# EasyEDA Pro project Source_r00fu_Synth .epro, board PCB1_1
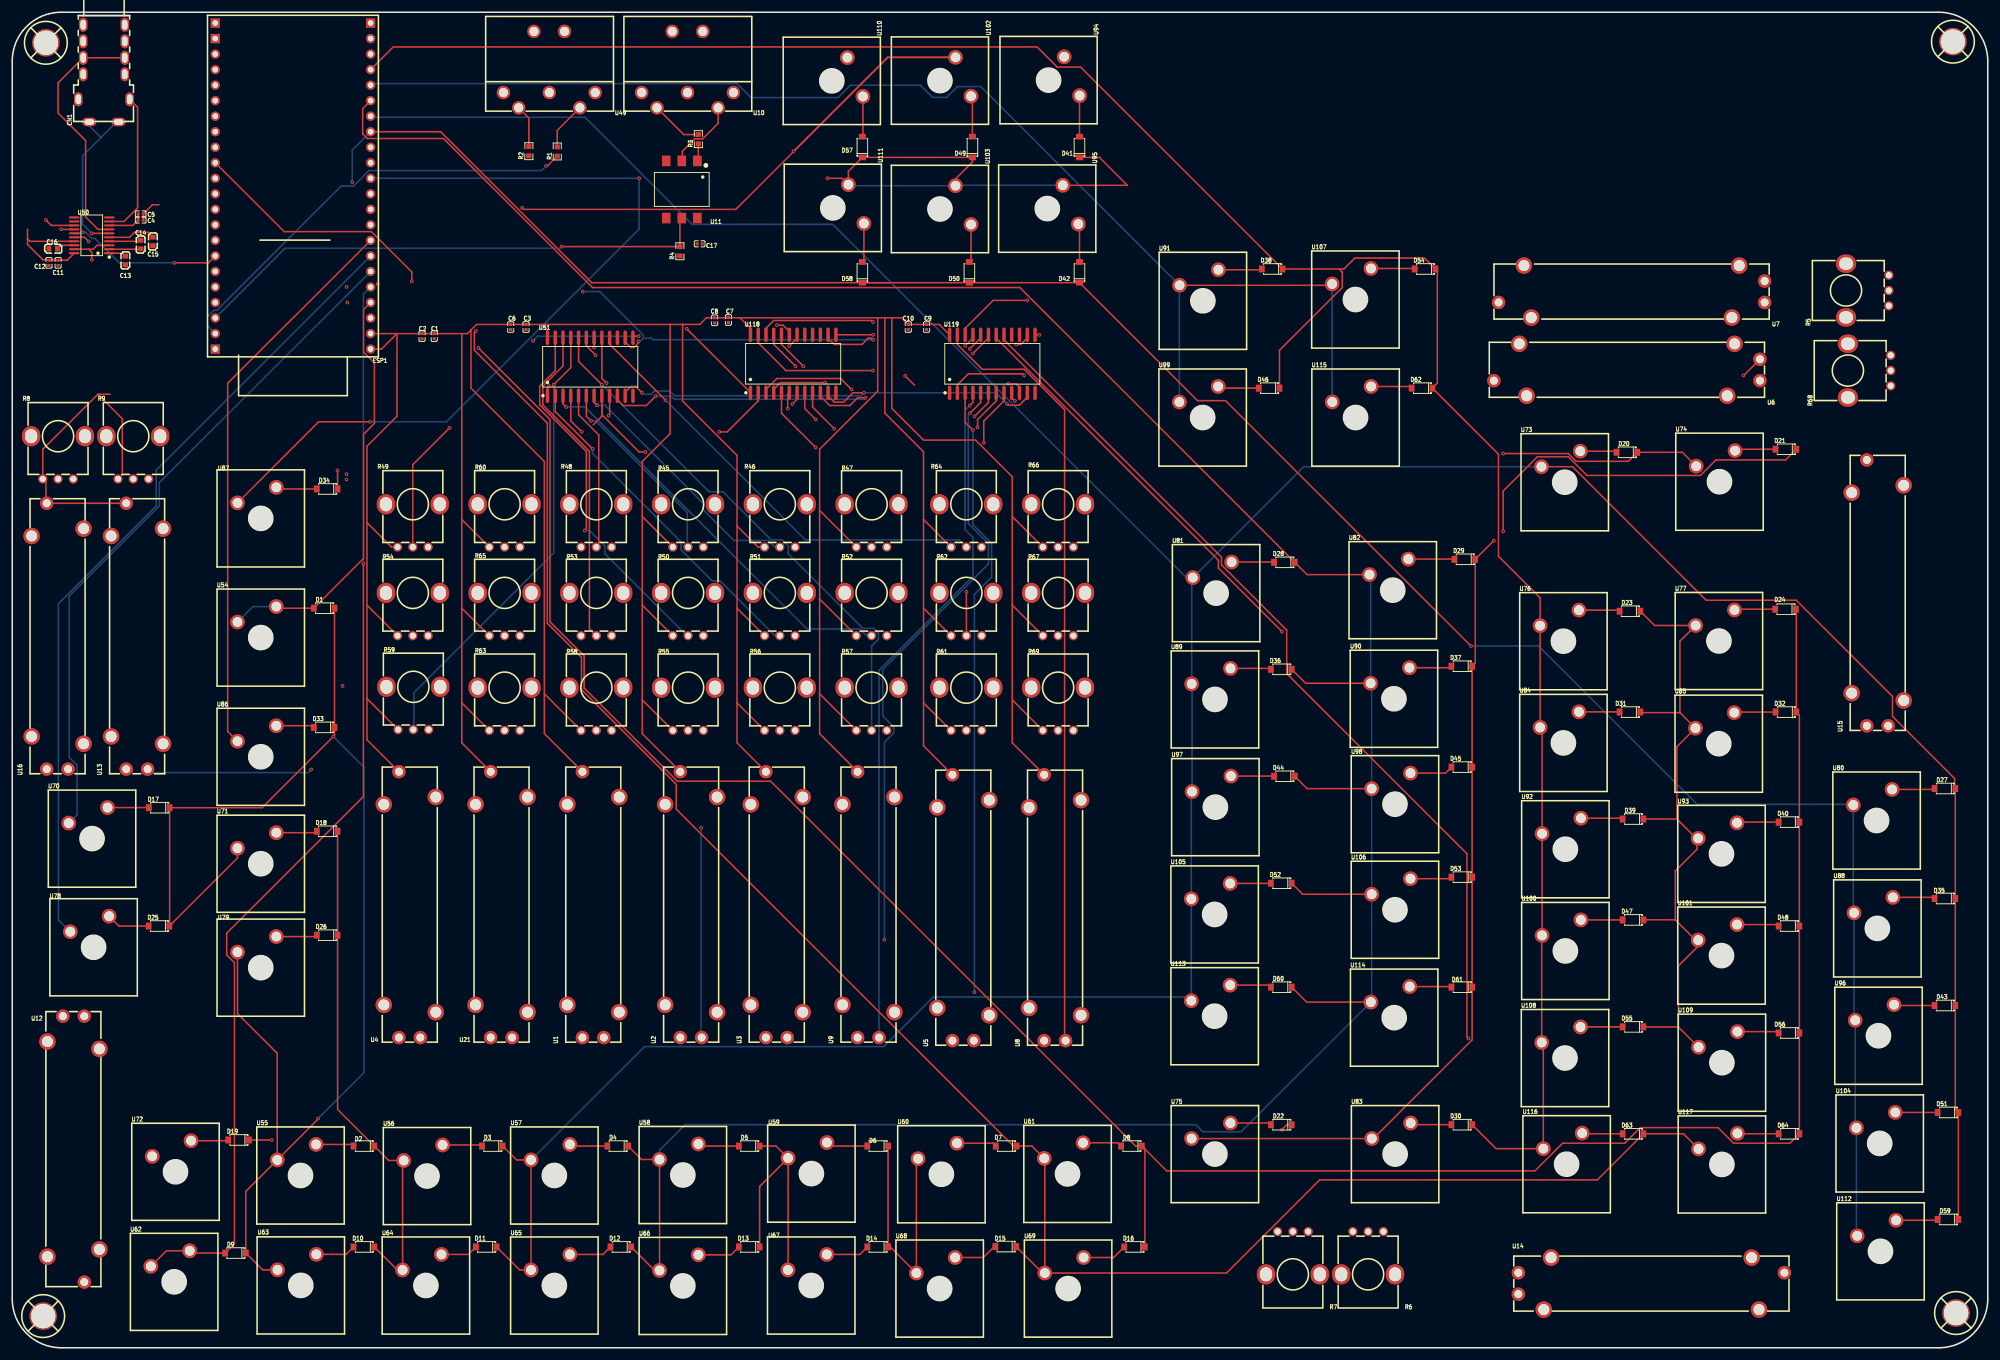
[diagram p3: board, top side]
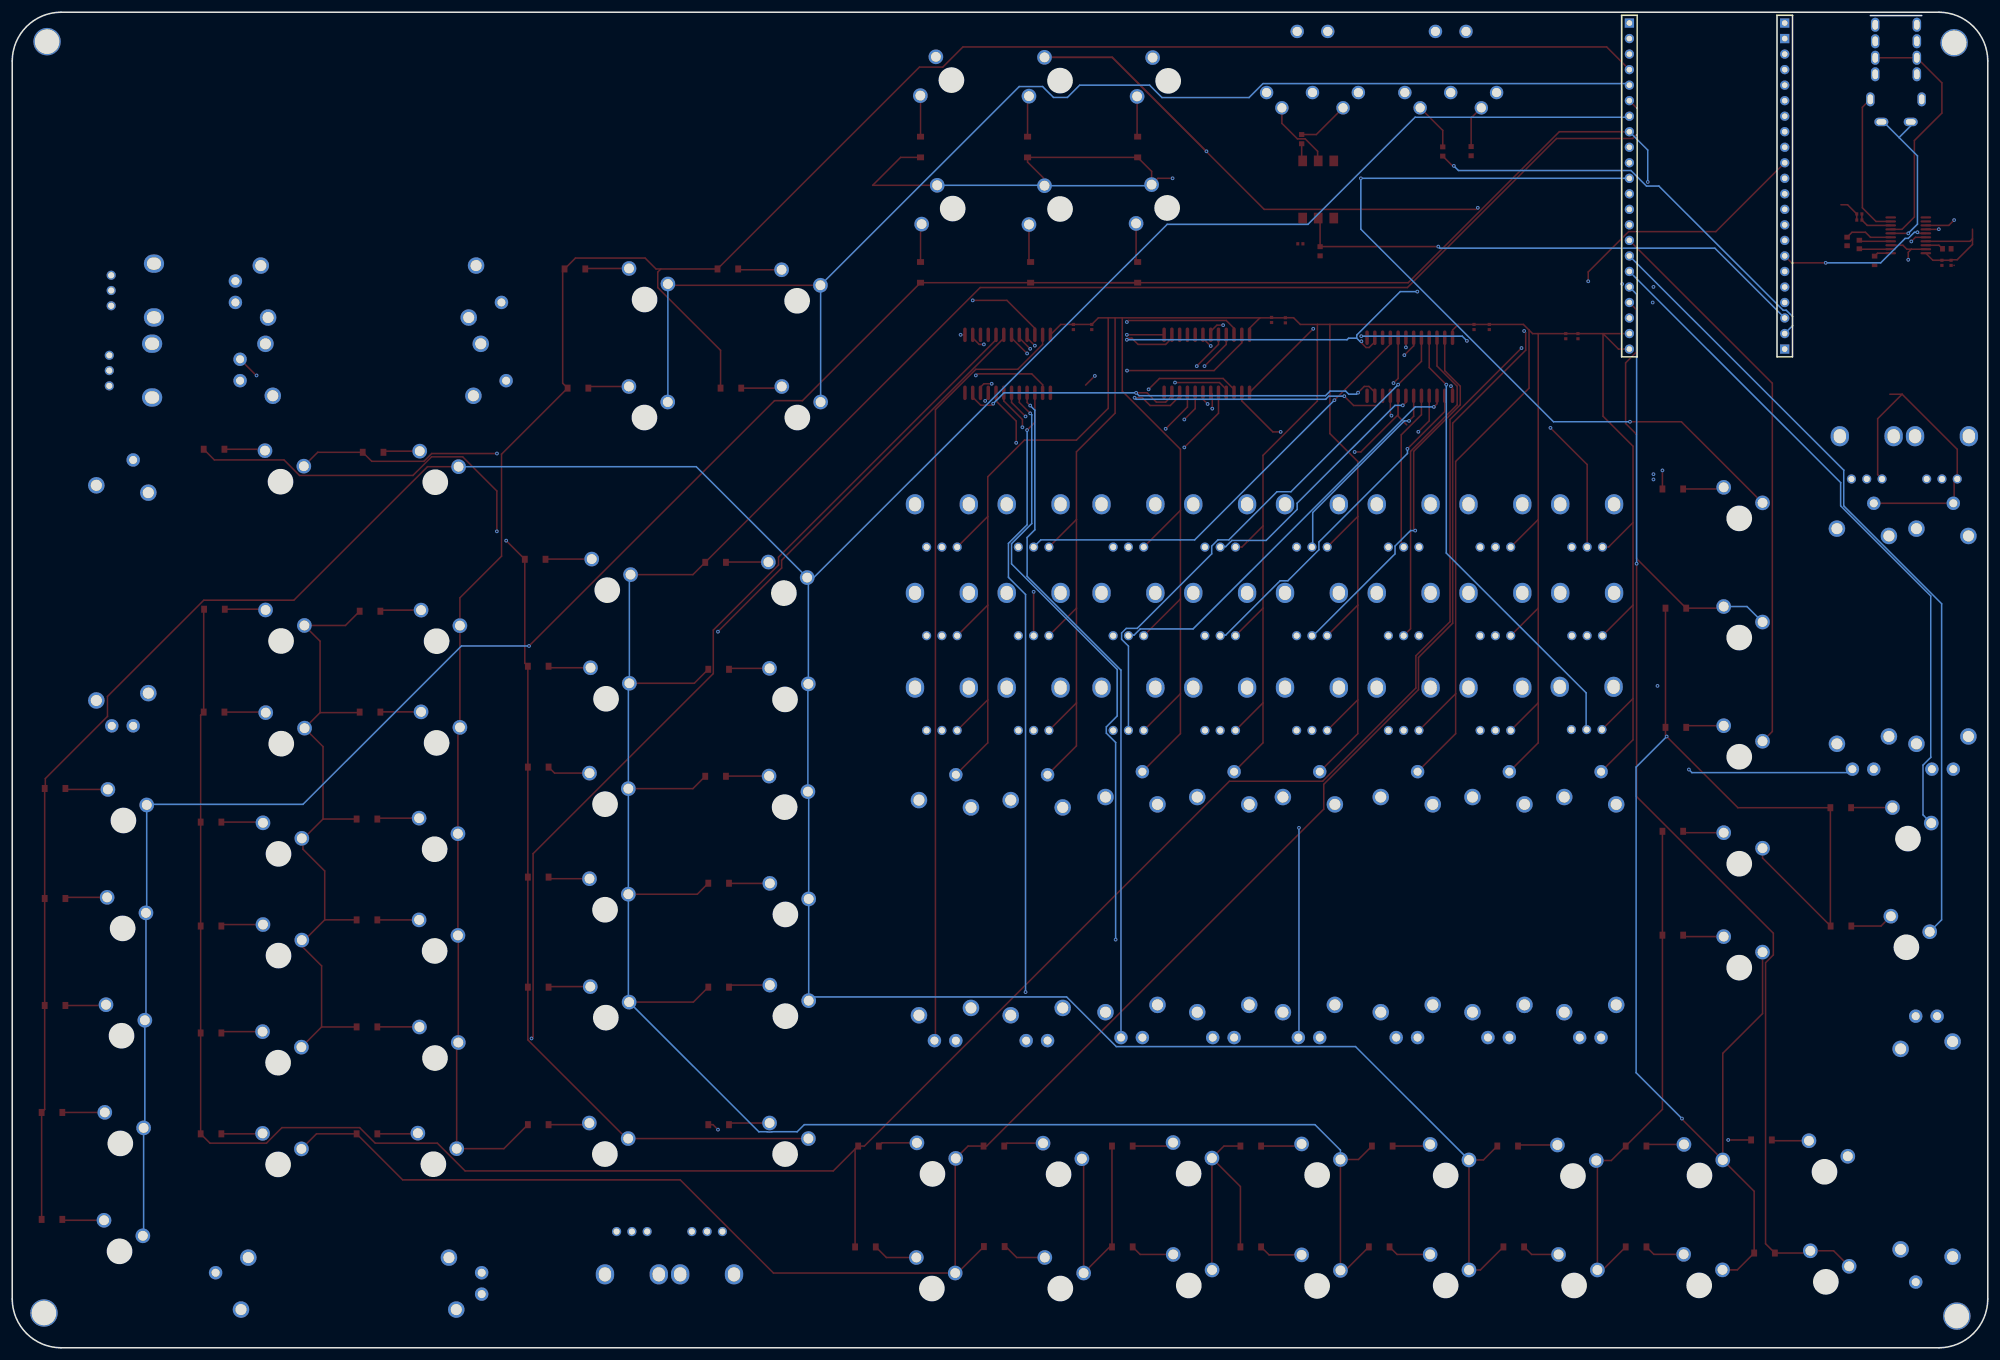
[diagram p4: board, bottom side, seen from below]

Outline 323 x 218.5 mm; copper layers: Top Layer, Inner1, Inner2, Bottom Layer. Coordinates in mm from the lower left corner of the outline.
Outline path: 0,210.5 0,8 arc(2.34,2.34) 8,0 315,0 arc(320.66,2.34) 323,8 323,210.5 arc(320.66,216.16) 315,218.5 8,218.5 arc(2.34,216.16) 0,210.5
Stack: Top Layer 0.035mm Outer layer thickness 1oz / Dielectric1 0.2104mm 7628 RC49% 8.6mil / Inner1 0.0152mm Inner layer thickness / Dielectric2 1.065mm 1.1mm H/HOZ Copper / Inner2 0.0152mm Inner layer thickness / Dielectric3 0.2104mm 7628 RC49% 8.6mil / Bottom Layer 0.035mm Outer layer thickness 1oz

## Design rules (mm)
spacing copperThickness1oz (default): track to track 0.102, other pairs 0.152 to 0.3
spacing copperThickness2oz: track to track 0.203, other pairs 0.152 to 0.3
track width copperThickness1oz (default): min 0.127, default 0.254, max 2.54
track width copperThickness2oz: min 0.203, default 0.254, max 2.54
differential pair differentialPair (default): width min 0.127, default 0.254, max 2.54; gap min 0.152, default 0.152

## Placement (name value [footprint] x y rotation side)
C1  100nF  [C0402]  69 165.5 90 top
C2  10uF  [C0402]  67 165.5 90 top
C3  100nF  [C0402]  84 167 90 top
C4  100nF  [C0402]  21 184.5 180 top
C5  10uF  [C0402]  21 185.5 180 top
C6  10uF  [C0402]  81.5 167 90 top
C7  100nF  [C0402]  117.1 168.16 90 top
C8  10uF  [C0402]  114.84 168.1 90 top
C9  100nF  [C0402]  149.5 167 90 top
C10  10uF  [C0402]  146.5 167 90 top
C11  100nF  [C0402]  7.5 177.5 90 top
C12  10uF  [C0402]  6 177.5 90 top
C13  1uF  [C0603]  18.5 177.9 270 top
C14  1uF  [C0603]  21 180.5 90 top
C15  1uF  [C0603]  23 181 270 top
C16  1uF  [C0603]  6.7 179.8 0 top
C17  100nF  [C0402]  112.39 180.61 180 top
CN1  PJ-4506B-01-Z  [AUDIO-TH_PJ-4506B-01-Z]  15 208.5 90 top
D1  1N4148W  [SOD-123_L2.8-W1.8-LS3.7-RD-1]  51 121 180 top
D2  1N4148W  [SOD-123_L2.8-W1.8-LS3.7-RD-1]  57.5 33 180 top
D3  1N4148W  [SOD-123_L2.8-W1.8-LS3.7-RD-1]  78.5 33 180 top
D4  1N4148W  [SOD-123_L2.8-W1.8-LS3.7-RD-1]  99 33 180 top
D5  1N4148W  [SOD-123_L2.8-W1.8-LS3.7-RD-1]  120.5 33 180 top
D6  1N4148W  [SOD-123_L2.8-W1.8-LS3.7-RD-1]  141.5 33 180 top
D7  1N4148W  [SOD-123_L2.8-W1.8-LS3.7-RD-1]  162.5 33 180 top
D8  1N4148W  [SOD-123_L2.8-W1.8-LS3.7-RD-1]  183 33 180 top
D9  1N4148W  [SOD-123_L2.8-W1.8-LS3.7-RD-1]  36.5 15.5 180 top
D10  1N4148W  [SOD-123_L2.8-W1.8-LS3.7-RD-1]  57.5 16.5 180 top
D11  1N4148W  [SOD-123_L2.8-W1.8-LS3.7-RD-1]  77.5 16.5 180 top
D12  1N4148W  [SOD-123_L2.8-W1.8-LS3.7-RD-1]  99.5 16.5 180 top
D13  1N4148W  [SOD-123_L2.8-W1.8-LS3.7-RD-1]  120.5 16.5 180 top
D14  1N4148W  [SOD-123_L2.8-W1.8-LS3.7-RD-1]  141.5 16.5 180 top
D15  1N4148W  [SOD-123_L2.8-W1.8-LS3.7-RD-1]  162.44 16.55 180 top
D16  1N4148W  [SOD-123_L2.8-W1.8-LS3.7-RD-1]  183.5 16.5 180 top
D17  1N4148W  [SOD-123_L2.8-W1.8-LS3.7-RD-1]  24.04 88.35 180 top
D18  1N4148W  [SOD-123_L2.8-W1.8-LS3.7-RD-1]  51.5 84.5 180 top
D19  1N4148W  [SOD-123_L2.8-W1.8-LS3.7-RD-1]  37 34 180 top
D20  1N4148W  [SOD-123_L2.8-W1.8-LS3.7-RD-1]  264 146.5 180 top
D21  1N4148W  [SOD-123_L2.8-W1.8-LS3.7-RD-1]  290 147 180 top
D22  1N4148W  [SOD-123_L2.8-W1.8-LS3.7-RD-1]  207.5 36.5 180 top
D23  1N4148W  [SOD-123_L2.8-W1.8-LS3.7-RD-1]  264.5 120.5 180 top
D24  1N4148W  [SOD-123_L2.8-W1.8-LS3.7-RD-1]  289.94 120.83 180 top
D25  1N4148W  [SOD-123_L2.8-W1.8-LS3.7-RD-1]  24 69 180 top
D26  1N4148W  [SOD-123_L2.8-W1.8-LS3.7-RD-1]  51.5 67.5 180 top
D27  1N4148W  [SOD-123_L2.8-W1.8-LS3.7-RD-1]  316 91.5 180 top
D28  1N4148W  [SOD-123_L2.8-W1.8-LS3.7-RD-1]  208 128.5 180 top
D29  1N4148W  [SOD-123_L2.8-W1.8-LS3.7-RD-1]  237.5 129 180 top
D30  1N4148W  [SOD-123_L2.8-W1.8-LS3.7-RD-1]  237 36.5 180 top
D31  1N4148W  [SOD-123_L2.8-W1.8-LS3.7-RD-1]  264.5 104 180 top
D32  1N4148W  [SOD-123_L2.8-W1.8-LS3.7-RD-1]  290 104 180 top
D33  1N4148W  [SOD-123_L2.8-W1.8-LS3.7-RD-1]  51 101.5 180 top
D34  1N4148W  [SOD-123_L2.8-W1.8-LS3.7-RD-1]  51.5 140.5 180 top
D35  1N4148W  [SOD-123_L2.8-W1.8-LS3.7-RD-1]  316 73.5 180 top
D36  1N4148W  [SOD-123_L2.8-W1.8-LS3.7-RD-1]  207.5 111 180 top
D37  1N4148W  [SOD-123_L2.8-W1.8-LS3.7-RD-1]  237 111.5 180 top
D38  1N4148W  [SOD-123_L2.8-W1.8-LS3.7-RD-1]  206 176.5 180 top
D39  1N4148W  [SOD-123_L2.8-W1.8-LS3.7-RD-1]  265 86.5 180 top
D40  1N4148W  [SOD-123_L2.8-W1.8-LS3.7-RD-1]  290.5 86 180 top
D41  1N4148W  [SOD-123_L2.8-W1.8-LS3.7-RD-1]  174.49 196.44 90 top
D42  1N4148W  [SOD-123_L2.8-W1.8-LS3.7-RD-1]  174.49 175.94 90 top
D43  1N4148W  [SOD-123_L2.8-W1.8-LS3.7-RD-1]  316 56 180 top
D44  1N4148W  [SOD-123_L2.8-W1.8-LS3.7-RD-1]  208 93.5 180 top
D45  1N4148W  [SOD-123_L2.8-W1.8-LS3.7-RD-1]  237 95 180 top
D46  1N4148W  [SOD-123_L2.8-W1.8-LS3.7-RD-1]  205.5 157 180 top
D47  1N4148W  [SOD-123_L2.8-W1.8-LS3.7-RD-1]  265 70 180 top
D48  1N4148W  [SOD-123_L2.8-W1.8-LS3.7-RD-1]  290.5 69 180 top
D49  1N4148W  [SOD-123_L2.8-W1.8-LS3.7-RD-1]  156.99 196.44 90 top
D50  1N4148W  [SOD-123_L2.8-W1.8-LS3.7-RD-1]  156.49 175.94 90 top
D51  1N4148W  [SOD-123_L2.8-W1.8-LS3.7-RD-1]  316.5 38.5 180 top
D52  1N4148W  [SOD-123_L2.8-W1.8-LS3.7-RD-1]  207.5 76 180 top
D53  1N4148W  [SOD-123_L2.8-W1.8-LS3.7-RD-1]  237 77 180 top
D54  1N4148W  [SOD-123_L2.8-W1.8-LS3.7-RD-1]  231 176.5 180 top
D55  1N4148W  [SOD-123_L2.8-W1.8-LS3.7-RD-1]  265 52.5 180 top
D56  1N4148W  [SOD-123_L2.8-W1.8-LS3.7-RD-1]  290.5 51.5 180 top
D57  1N4148W  [SOD-123_L2.8-W1.8-LS3.7-RD-1]  138.99 196.44 90 top
D58  1N4148W  [SOD-123_L2.8-W1.8-LS3.7-RD-1]  138.99 175.94 90 top
D59  1N4148W  [SOD-123_L2.8-W1.8-LS3.7-RD-1]  316.5 21 180 top
D60  1N4148W  [SOD-123_L2.8-W1.8-LS3.7-RD-1]  207.5 59 180 top
D61  1N4148W  [SOD-123_L2.8-W1.8-LS3.7-RD-1]  237 59 180 top
D62  1N4148W  [SOD-123_L2.8-W1.8-LS3.7-RD-1]  230.5 157 180 top
D63  1N4148W  [SOD-123_L2.8-W1.8-LS3.7-RD-1]  265 35 180 top
D64  1N4148W  [SOD-123_L2.8-W1.8-LS3.7-RD-1]  290.5 35 180 top
ESP1  ESP32-S3-DEVKITC-MINI  [ESP32S3-DEVKIT-C1-V10]  58.6 163.39 180 top
R1  220Ω  [R0603]  89.11 195.72 90 top
R2  220Ω  [R0603]  84.47 195.77 90 top
R3  220Ω  [R0603]  112.18 197.74 90 top
R4  10kΩ  [R0603]  109.16 179.39 90 top
R5  10kΩ  [RES-ADJ-TH_RK09K1130A5R]  303.32 172.97 90 top
R6  10kΩ  [RES-ADJ-TH_RK09K1130A5R]  221.69 15.51 180 top
R7  10kΩ  [RES-ADJ-TH_RK09K1130A5R]  209.39 15.51 180 top
R8  10kΩ  [RES-ADJ-TH_RK09K1130A5R]  7.49 145.64 0 top
R9  10kΩ  [RES-ADJ-TH_RK09K1130A5R]  19.79 145.64 0 top
R45  10kΩ  [RES-ADJ-TH_RK09K1130A5R]  110.5 134.5 0 top
R46  10kΩ  [RES-ADJ-TH_RK09K1130A5R]  125.5 134.5 0 top
R47  10kΩ  [RES-ADJ-TH_RK09K1130A5R]  140.5 134.5 0 top
R48  10kΩ  [RES-ADJ-TH_RK09K1130A5R]  95.5 134.5 0 top
R49  10kΩ  [RES-ADJ-TH_RK09K1130A5R]  65.5 134.5 0 top
R50  10kΩ  [RES-ADJ-TH_RK09K1130A5R]  110.5 120 0 top
R51  10kΩ  [RES-ADJ-TH_RK09K1130A5R]  125.5 120 0 top
R52  10kΩ  [RES-ADJ-TH_RK09K1130A5R]  140.5 120 0 top
R53  10kΩ  [RES-ADJ-TH_RK09K1130A5R]  95.5 120 0 top
R54  10kΩ  [RES-ADJ-TH_RK09K1130A5R]  65.5 120 0 top
R55  10kΩ  [RES-ADJ-TH_RK09K1130A5R]  110.5 104.5 0 top
R56  10kΩ  [RES-ADJ-TH_RK09K1130A5R]  125.5 104.5 0 top
R57  10kΩ  [RES-ADJ-TH_RK09K1130A5R]  140.5 104.5 0 top
R58  10kΩ  [RES-ADJ-TH_RK09K1130A5R]  95.5 104.5 0 top
R59  10kΩ  [RES-ADJ-TH_RK09K1130A5R]  65.58 104.63 0 top
R60  10kΩ  [RES-ADJ-TH_RK09K1130A5R]  80.5 134.5 0 top
R61  10kΩ  [RES-ADJ-TH_RK09K1130A5R]  156 104.5 0 top
R62  10kΩ  [RES-ADJ-TH_RK09K1130A5R]  156 120 0 top
R63  10kΩ  [RES-ADJ-TH_RK09K1130A5R]  80.5 104.5 0 top
R64  10kΩ  [RES-ADJ-TH_RK09K1130A5R]  156 134.5 0 top
R65  10kΩ  [RES-ADJ-TH_RK09K1130A5R]  80.5 120 0 top
R66  10kΩ  [RES-ADJ-TH_RK09K1130A5R]  171 134.5 0 top
R67  10kΩ  [RES-ADJ-TH_RK09K1130A5R]  171 120 0 top
R68  10kΩ  [RES-ADJ-TH_RK09K1130A5R]  303.63 159.87 90 top
R69  10kΩ  [RES-ADJ-TH_RK09K1130A5R]  171 104.5 0 top
SCREW1  -  [Screw-Hole-M4]  5.5 213.5 0 top
SCREW2  -  [Screw-Hole-M4]  317.31 213.69 0 top
SCREW3  -  [Screw-Hole-M4]  5.06 5.19 0 top
SCREW4  -  [Screw-Hole-M4]  317.81 5.69 0 top
U1  PTA3043-2010CIB103  [RES-ADJ-TH_PTA3043]  95 72.5 90 top
U2  PTA3043-2010CIB103  [RES-ADJ-TH_PTA3043]  111 72.5 90 top
U3  PTA3043-2010CIB103  [RES-ADJ-TH_PTA3043]  125 72.5 90 top
U4  PTA3043-2010CIB103  [RES-ADJ-TH_PTA3043]  65 72.5 90 top
U5  PTA3043-2010CIB103  [RES-ADJ-TH_PTA3043]  155.5 72 90 top
U6  PTA3043-2010CIB103  [RES-ADJ-TH_PTA3043]  264 160 180 top
U7  PTA3043-2010CIB103  [RES-ADJ-TH_PTA3043]  264.76 172.8 180 top
U8  PTA3043-2010CIB103  [RES-ADJ-TH_PTA3043]  170.5 72 90 top
U9  PTA3043-2010CIB103  [RES-ADJ-TH_PTA3043]  140 72.5 90 top
U10  DIN-504D-M5  [CONN-TH_DIN-504D-M5]  110.41 209.11 180 top
U11  H11L1SR2M  [SMD-6_L8.7-W6.5-P2.54-LS10.6-BL]  109.47 189.5 180 top
U12  PTA3043-2010CIB103  [RES-ADJ-TH_PTA3043]  10 32.5 270 top
U13  PTA3043-2010CIB103  [RES-ADJ-TH_PTA3043]  20.41 116.41 90 top
U14  PTA3043-2010CIB103  [RES-ADJ-TH_PTA3043]  268 10.5 0 top
U15  PTA3043-2010CIB103  [RES-ADJ-TH_PTA3043]  305 123.5 90 top
U16  PTA3043-2010CIB103  [RES-ADJ-TH_PTA3043]  7.41 116.41 90 top
U21  PTA3043-2010CIB103  [RES-ADJ-TH_PTA3043]  80 72.5 90 top
U49  DIN-504D-M5  [CONN-TH_DIN-504D-M5]  87.81 209.11 180 top
U50  PCM5102APW  [TSSOP-20_L6.5-W4.4-P0.65-LS6.4-BL]  13 182 90 top
U51  CD74HC4067M  [SOIC-24_L15.4-W7.5-P1.27-LS10.3-BL]  94.5 160.5 0 top
U54  CPG151101D01  [SW-TH_CPG151101D9X]  40 120 0 top
U55  CPG151101D01  [SW-TH_CPG151101D9X]  46.5 32 0 top
U56  CPG151101D01  [SW-TH_CPG151101D9X]  67.19 31.91 0 top
U57  CPG151101D01  [SW-TH_CPG151101D9X]  88 32 0 top
U58  CPG151101D01  [SW-TH_CPG151101D9X]  109.01 32.07 0 top
U59  CPG151101D01  [SW-TH_CPG151101D9X]  130.03 32.31 0 top
U60  CPG151101D01  [SW-TH_CPG151101D9X]  151.29 32.2 0 top
U61  CPG151101D01  [SW-TH_CPG151101D9X]  171.91 32.26 0 top
U62  CPG151101D01  [SW-TH_CPG151101D9X]  25.84 14.6 0 top
U63  CPG151101D01  [SW-TH_CPG151101D9X]  46.55 14.02 0 top
U64  CPG151101D01  [SW-TH_CPG151101D9X]  67 14 0 top
U65  CPG151101D01  [SW-TH_CPG151101D9X]  88 14 0 top
U66  CPG151101D01  [SW-TH_CPG151101D9X]  109.01 13.93 0 top
U67  CPG151101D01  [SW-TH_CPG151101D9X]  130 14 0 top
U68  CPG151101D01  [SW-TH_CPG151101D9X]  151 13.5 0 top
U69  CPG151101D01  [SW-TH_CPG151101D9X]  172 13.5 0 top
U70  CPG151101D01  [SW-TH_CPG151101D9X]  12.41 87.11 0 top
U71  CPG151101D01  [SW-TH_CPG151101D9X]  40 83 0 top
U72  CPG151101D01  [SW-TH_CPG151101D9X]  26.06 32.6 0 top
U73  CPG151101D01  [SW-TH_CPG151101D9X]  253.2 145.42 0 top
U74  CPG151101D01  [SW-TH_CPG151101D9X]  278.5 145.5 0 top
U75  CPG151101D01  [SW-TH_CPG151101D9X]  196 35.5 0 top
U76  CPG151101D01  [SW-TH_CPG151101D9X]  252.98 119.41 0 top
U77  CPG151101D01  [SW-TH_CPG151101D9X]  278.41 119.44 0 top
U78  CPG151101D01  [SW-TH_CPG151101D9X]  12.67 69.34 0 top
U79  CPG151101D01  [SW-TH_CPG151101D9X]  40 66 0 top
U80  CPG151101D01  [SW-TH_CPG151101D9X]  304.19 90.08 0 top
U81  CPG151101D01  [SW-TH_CPG151101D9X]  196.2 127.28 0 top
U82  CPG151101D01  [SW-TH_CPG151101D9X]  225.08 127.76 0 top
U83  CPG151101D01  [SW-TH_CPG151101D9X]  225.47 35.5 0 top
U84  CPG151101D01  [SW-TH_CPG151101D9X]  252.98 102.77 0 top
U85  CPG151101D01  [SW-TH_CPG151101D9X]  278.38 102.64 0 top
U86  CPG151101D01  [SW-TH_CPG151101D9X]  40 100.5 0 top
U87  CPG151101D01  [SW-TH_CPG151101D9X]  40 139.5 0 top
U88  CPG151101D01  [SW-TH_CPG151101D9X]  304.31 72.42 0 top
U89  CPG151101D01  [SW-TH_CPG151101D9X]  196.01 109.88 0 top
U90  CPG151101D01  [SW-TH_CPG151101D9X]  225.28 109.99 0 top
U91  CPG151101D01  [SW-TH_CPG151101D9X]  194.04 175.1 0 top
U92  CPG151101D01  [SW-TH_CPG151101D9X]  253.3 85.38 0 top
U93  CPG151101D01  [SW-TH_CPG151101D9X]  278.83 84.61 0 top
U94  CPG151101D01  [SW-TH_CPG151101D9X]  173.25 208.03 270 top
U95  CPG151101D01  [SW-TH_CPG151101D9X]  173.04 187.01 270 top
U96  CPG151101D01  [SW-TH_CPG151101D9X]  304.5 54.86 0 top
U97  CPG151101D01  [SW-TH_CPG151101D9X]  196.08 92.26 0 top
U98  CPG151101D01  [SW-TH_CPG151101D9X]  225.44 92.75 0 top
U99  CPG151101D01  [SW-TH_CPG151101D9X]  194 156 0 top
U100  CPG151101D01  [SW-TH_CPG151101D9X]  253.3 68.73 0 top
U101  CPG151101D01  [SW-TH_CPG151101D9X]  278.83 67.97 0 top
U102  CPG151101D01  [SW-TH_CPG151101D9X]  155.49 207.94 270 top
U103  CPG151101D01  [SW-TH_CPG151101D9X]  155.49 186.94 270 top
U104  CPG151101D01  [SW-TH_CPG151101D9X]  304.69 37.24 0 top
U105  CPG151101D01  [SW-TH_CPG151101D9X]  195.95 74.71 0 top
U106  CPG151101D01  [SW-TH_CPG151101D9X]  225.44 75.47 0 top
U107  CPG151101D01  [SW-TH_CPG151101D9X]  218.98 175.31 0 top
U108  CPG151101D01  [SW-TH_CPG151101D9X]  253.24 51.21 0 top
U109  CPG151101D01  [SW-TH_CPG151101D9X]  278.9 50.45 0 top
U110  CPG151101D01  [SW-TH_CPG151101D9X]  137.81 207.9 270 top
U111  CPG151101D01  [SW-TH_CPG151101D9X]  137.98 187.12 270 top
U112  CPG151101D01  [SW-TH_CPG151101D9X]  304.82 19.59 0 top
U113  CPG151101D01  [SW-TH_CPG151101D9X]  195.95 58.06 0 top
U114  CPG151101D01  [SW-TH_CPG151101D9X]  225.31 57.82 0 top
U115  CPG151101D01  [SW-TH_CPG151101D9X]  219 156 0 top
U116  CPG151101D01  [SW-TH_CPG151101D9X]  253.51 33.84 0 top
U117  CPG151101D01  [SW-TH_CPG151101D9X]  278.9 33.81 0 top
U118  CD74HC4067M  [SOIC-24_L15.4-W7.5-P1.27-LS10.3-BL]  127.68 160.99 0 top
U119  CD74HC4067M  [SOIC-24_L15.4-W7.5-P1.27-LS10.3-BL]  160.25 160.98 0 top

## Footprints (pads in the part's own frame, mm; a bottom-side part is the same pattern mirrored in y, then rotated)
AUDIO-TH_PJ-4506B-01-Z
  oval 2.3x1.4 hole 1.6x0.9: A(7.95,-3.4) B(5.25,-3.4) C(2.55,-3.4) D(-0.15,-3.4) E(7.95,3.4) F(5.25,3.4) G(2.55,3.4) H(-0.15,3.4) K(-4.25,-4.2) L(-4.25,4.2)
  oval 1.4x2.3 hole 0.9x1.6: I(-7.95,-2.4) J(-7.95,2.4)
C0402
  rect 0.5x0.54 smd: 1(-0.42,0) 2(0.42,0)
C0603
  rect 0.8x0.9 smd: 1(-0.7,0) 2(0.7,0)
CONN-TH_DIN-504D-M5
  round 2.2 hole 1.5: 1(7.5,3.75) 2(0,3.75) 3(-7.5,3.75) 4(5,6.25) 5(-5,6.25) 6(-2.5,-6.25) 7(2.5,-6.25)
ESP32S3-DEVKIT-C1-V10
  round 1.524 hole 0.914: 0(25.4,-33.02) 1(25.4,-7.62) 2(25.4,-10.16) 3(0,-30.48) 4(0,-7.62) 5(0,-10.16) 5V(0,-50.8) 6(0,-12.7) 7(0,-15.24) 8(0,-27.94) 9(0,-35.56) 10(0,-38.1) 11(0,-40.64) 12(0,-43.18) 13(0,-45.72) 14(0,-48.26) 15(0,-17.78) 16(0,-20.32) 17(0,-22.86) 18(0,-25.4) 19(25.4,-48.26) 20(25.4,-45.72) 21(25.4,-43.18) 35(25.4,-30.48) 36(25.4,-27.94) 37(25.4,-25.4) 38(25.4,-22.86) 39(25.4,-20.32) 40(25.4,-17.78) 41(25.4,-15.24) 42(25.4,-12.7) 45(25.4,-35.56) 46(0,-33.02) 47(25.4,-40.64) 48(25.4,-38.1) RST(0,-5.08) RX(25.4,-5.08) TX(25.4,-2.54) VDD_1(0,0) VDD_2(0,-2.54)
  rect 1.524x1.524 hole 0.914: G1(0,-53.34) G2(25.4,0) G3(25.4,-50.8) G4(25.4,-53.34)
R0603
  rect 0.806x0.864 smd: 1(-0.753,0) 2(0.753,0)
RES-ADJ-TH_PTA3043
  round 2.2 hole 1.3: 1(-21.75,1.778) 2(-21.75,-1.722) 3(21.75,1.778)
  round 2.7 hole 1.8: 4(16.4,4.25) 5(-16.4,4.25) 6(-17.6,-4.25) 7(17.6,-4.25)
RES-ADJ-TH_RK09K1130A5R
  round 1.5 hole 1: 1(-2.5,-3.5) 2(0,-3.5) 3(2.5,-3.5)
  oval 3x3.3 hole 2x2.3: 4(4.4,3.5) 5(-4.4,3.5)
Screw-Hole-M4
  round 4.5 hole 4: 1(0,0)
SMD-6_L8.7-W6.5-P2.54-LS10.6-BL
  rect 1.423x1.75 smd: 1(-2.54,-4.675) 2(0,-4.675) 3(2.54,-4.675) 4(2.54,4.675) 5(0,4.675) 6(-2.54,4.675)
SOD-123_L2.8-W1.8-LS3.7-RD-1
  rect 0.95x1.15 smd: 1(-1.692,0) 2(1.692,0)
SOIC-24_L15.4-W7.5-P1.27-LS10.3-BL
  oval 0.574x2.388 smd: 1(-6.985,-4.744) 2(-5.715,-4.744) 3(-4.445,-4.744) 4(-3.175,-4.744) 5(-1.905,-4.744) 6(-0.635,-4.744) 7(0.635,-4.744) 8(1.905,-4.744) 9(3.175,-4.744) 10(4.445,-4.744) 11(5.715,-4.744) 12(6.985,-4.744) 13(6.985,4.744) 14(5.715,4.744) 15(4.445,4.744) 16(3.175,4.744) 17(1.905,4.744) 18(0.635,4.744) 19(-0.635,4.744) 20(-1.905,4.744) 21(-3.175,4.744) 22(-4.445,4.744) 23(-5.715,4.744) 24(-6.985,4.744)
SW-TH_CPG151101D9X
  round 2.4 hole 1.6: 1(-3.175,-1.27) 2(3.175,1.27)
TSSOP-20_L6.5-W4.4-P0.65-LS6.4-BL
  oval 0.364x1.742 smd: 1(-2.925,-2.871) 2(-2.275,-2.871) 3(-1.625,-2.871) 4(-0.975,-2.871) 5(-0.325,-2.871) 6(0.325,-2.871) 7(0.975,-2.871) 8(1.625,-2.871) 9(2.275,-2.871) 10(2.925,-2.871) 11(2.925,2.871) 12(2.275,2.871) 13(1.625,2.871) 14(0.975,2.871) 15(0.325,2.871) 16(-0.325,2.871) 17(-0.975,2.871) 18(-1.625,2.871) 19(-2.275,2.871) 20(-2.925,2.871)

## Nets
+3.3V: C1.2 C2.2 C3.2 C4.2 C5.2 C6.2 C7.2 C8.2 C9.2 C10.2 C11.2 C12.2 C13.1 C17.2 ESP1.VDD_1 ESP1.VDD_2 R2.1 R4.1 R5.1 R6.1 R7.1 R8.1 R9.1 R45.1 R46.1 R47.1 R48.1 R49.1 R50.1 R51.1 R52.1 R53.1 R54.1 R55.1 R56.1 R57.1 R58.1 R59.1 R60.1 R61.1 R62.1 R63.1 R64.1 R65.1 R66.1 R67.1 R68.1 R69.1 U1.3 U2.3 U3.3 U4.3 U5.3 U6.3 U7.3 U8.3 U9.3 U11.6 U12.3 U13.3 U14.3 U15.3 U16.3 U21.3 U50.1 U50.8 U50.17 U50.20 U51.24 U118.24 U119.24
+5V: ESP1.5V
AGND: CN1.K U50.9
GND: C1.1 C2.1 C3.1 C4.1 C5.1 C6.1 C7.1 C8.1 C9.1 C10.1 C11.1 C12.1 C13.2 C15.2 C16.1 C17.1 CN1.A CN1.E ESP1.G1 ESP1.G2 ESP1.G3 ESP1.G4 R5.3 R6.3 R7.3 R8.3 R45.3 R46.3 R47.3 R48.3 R49.3 R50.3 R51.3 R52.3 R53.3 R54.3 R55.3 R56.3 R57.3 R58.3 R59.3 R60.3 R61.3 R62.3 R63.3 R64.3 R65.3 R66.3 R67.3 R68.3 R69.3 SCREW1.1 SCREW2.1 SCREW3.1 SCREW4.1 U1.1 U2.1 U3.1 U4.1 U5.1 U6.1 U7.1 U8.1 U9.1 U11.4 U12.1 U13.1 U14.1 U15.1 U16.1 U21.1 U49.2 U50.3 U50.10 U50.11 U50.16 U50.19 U51.12 U51.15 U118.12 U118.15 U119.12 U119.15
1S0: ESP1.35 U51.10 U118.10 U119.10
1S1: ESP1.36 U51.11 U118.11 U119.11
1S2: ESP1.37 U51.14 U118.14 U119.14
1S3: ESP1.38 U51.13 U118.13 U119.13
A0: R49.2 U51.9
A1: R47.2 U51.8
A2: R46.2 U51.7
A3: R45.2 U51.6
A4: R48.2 U51.5
A5: R54.2 U51.4
A6: R52.2 U51.3
A7: R51.2 U51.2
A8: R50.2 U51.23
A9: R53.2 U51.22
A10: R59.2 U51.21
A11: R57.2 U51.20
A12: R56.2 U51.19
A13: R55.2 U51.18
A14: R58.2 U51.17
A15: R64.2 U51.16
B0: R62.2 U118.9
B1: R61.2 U118.8
B2: R60.2 U118.7
B3: R63.2 U118.6
B4: R69.2 U118.5
B5: R67.2 U118.4
B6: R66.2 U118.3
B7: R65.2 U118.2
B8: R68.2 U118.23
B9: R5.2 U118.22
B10: R6.2 U118.21
B11: R7.2 U118.20
B12: R8.2 U118.19
B13: R9.2 U118.18
B14: U118.17
B15: U118.16
BCK: ESP1.40 U50.13
C0: U21.2 U119.9
C1: U1.2 U119.8
C2: U2.2 U119.7
C3: U4.2 U119.6
C4: U3.2 U119.5
C5: U9.2 U119.4
C6: U5.2 U119.3
C7: U6.2 U119.2
C8: U8.2 U119.23
C9: U7.2 U119.22
C10: U16.2 U119.21
C11: U12.2 U119.20
C12: U13.2 U119.19
C13: U15.2 U119.18
C14: U14.2 U119.17
C15: U119.16
COL1: D1.1 D9.1 D17.1 D25.1 D33.1 D41.1 D49.1 D57.1 ESP1.8 U55.1 U63.1 U71.1 U79.1 U87.1 U95.1 U103.1 U111.1
COL2: D2.1 D10.1 D18.1 D26.1 D34.1 D42.1 D50.1 D58.1 ESP1.9 U56.1 U64.1 U72.1 U80.1 U88.1 U96.1 U104.1 U112.1
COL3: D3.1 D11.1 D19.1 D27.1 D35.1 D43.1 D51.1 D59.1 ESP1.10 U57.1 U65.1 U73.1 U81.1 U89.1 U97.1 U105.1 U113.1
COL4: D4.1 D12.1 D20.1 D28.1 D36.1 D44.1 D52.1 D60.1 ESP1.11 U58.1 U66.1 U74.1 U82.1 U90.1 U98.1 U106.1 U114.1
COL5: D5.1 D13.1 D21.1 D29.1 D37.1 D45.1 D53.1 D61.1 ESP1.12 U59.1 U67.1 U75.1 U83.1 U91.1 U99.1 U107.1 U115.1
COL6: D6.1 D14.1 D22.1 D30.1 D38.1 D46.1 D54.1 D62.1 ESP1.13 U60.1 U68.1 U76.1 U84.1 U92.1 U100.1 U108.1 U116.1
COL7: D7.1 D15.1 D23.1 D31.1 D39.1 D47.1 D55.1 D63.1 ESP1.14 U61.1 U69.1 U77.1 U85.1 U93.1 U101.1 U109.1 U117.1
COL8: D8.1 D16.1 D24.1 D32.1 D40.1 D48.1 D56.1 D64.1 ESP1.21
DIN: ESP1.42 U50.14
DIN_IN: ESP1.RX R4.2 U11.5
LRCK: ESP1.41 U50.15
MUXA_OUT: ESP1.1 U51.1
MUXB_OUT: ESP1.2 U118.1
MUXC_OUT: ESP1.3 U119.1
OUTL: CN1.I CN1.J U50.6
OUTR: CN1.C CN1.G U50.7
ROW1: D1.2 ESP1.4 U54.1 U54.2
ROW2: D9.2 ESP1.5 U62.1 U62.2
ROW3: ESP1.6 U70.1
ROW4: ESP1.7 U78.1
ROW5: ESP1.15 U86.1
ROW6: ESP1.16 U94.1
ROW7: ESP1.17 U102.1
ROW8: ESP1.18 U110.1
TX: ESP1.TX R1.1
$1N26761: D2.2 U55.2
$1N26911: D4.2 U57.2
$1N26913: D3.2 U56.2
$1N27211: D6.2 U59.2
$1N27213: D5.2 U58.2
$1N27215: D8.2 U61.2
$1N27217: D7.2 U60.2
$1N32107: D12.2 U65.2
$1N32109: D11.2 U64.2
$1N32111: D13.2 U66.2
$1N32113: D16.2 U69.2
$1N32117: D14.2 U67.2
$1N32119: D15.2 U68.2
$1N32129: D10.2 U63.2
$1N33315: D17.2 U70.2
$1N33317: D18.2 U71.2
$1N33319: D19.2 U72.2
$1N33321: D20.2 U73.2
$1N33323: D21.2 U74.2
$1N33325: D22.2 U75.2
$1N33327: D23.2 U76.2
$1N33329: D24.2 U77.2
$1N33345: D25.2 U78.2
$1N33347: D26.2 U79.2
$1N33349: D27.2 U80.2
$1N33351: D28.2 U81.2
$1N33353: D29.2 U82.2
$1N33355: D30.2 U83.2
$1N33357: D31.2 U84.2
$1N33359: D32.2 U85.2
$1N35743: D33.2 U86.2
$1N35745: D34.2 U87.2
$1N35747: D35.2 U88.2
$1N35749: D36.2 U89.2
$1N35751: D37.2 U90.2
$1N35753: D38.2 U91.2
$1N35755: D39.2 U92.2
$1N35757: D40.2 U93.2
$1N35773: D41.2 U94.2
$1N35775: D42.2 U95.2
$1N35777: D43.2 U96.2
$1N35779: D44.2 U97.2
$1N35781: D45.2 U98.2
$1N35783: D46.2 U99.2
$1N35785: D47.2 U100.2
$1N35787: D48.2 U101.2
$1N35803: D49.2 U102.2
$1N35805: D50.2 U103.2
$1N35807: D51.2 U104.2
$1N35809: D52.2 U105.2
$1N35811: D53.2 U106.2
$1N35813: D54.2 U107.2
$1N35815: D55.2 U108.2
$1N35817: D56.2 U109.2
$1N35833: D57.2 U110.2
$1N35835: D58.2 U111.2
$1N35837: D59.2 U112.2
$1N35839: D60.2 U113.2
$1N35841: D61.2 U114.2
$1N35843: D62.2 U115.2
$1N35845: D63.2 U116.2
$1N35847: D64.2 U117.2
$1N41810: C14.1 U50.2
$1N41812: C15.1 U50.5
$1N41842: C16.2 U50.18
$1N41846: R1.2 U49.5
$1N41847: R2.2 U49.4
$1N41854: R3.2 U10.4
$1N41855: R3.1 U11.1
$1N41856: U10.5 U11.2
$1N41902: C14.2 U50.4

Pads without a net: CN1 B D F H L; ESP1 0 19 20 39 45 46 47 48 RST; R5 4 5; R6 4 5; R7 4 5; R8 4 5; R9 3 4 5; R45 4 5; R46 4 5; R47 4 5; R48 4 5; R49 4 5; R50 4 5; R51 4 5; R52 4 5; R53 4 5; R54 4 5; R55 4 5; R56 4 5; R57 4 5; R58 4 5; R59 4 5; R60 4 5; R61 4 5; R62 4 5; R63 4 5; R64 4 5; R65 4 5; R66 4 5; R67 4 5; R68 4 5; R69 4 5; U1 4 5 6 7; U2 4 5 6 7; U3 4 5 6 7; U4 4 5 6 7; U5 4 5 6 7; U6 4 5 6 7; U7 4 5 6 7; U8 4 5 6 7; U9 4 5 6 7; U10 1 2 3 6 7; U11 3; U12 4 5 6 7; U13 4 5 6 7; U14 4 5 6 7; U15 4 5 6 7; U16 4 5 6 7; U21 4 5 6 7; U49 1 3 6 7; U50 12

## Via types
v1: diameter 0.61, hole 0.305, Top Layer to Bottom Layer, 100 vias

## Routing (per net, layer and track width the routed paths; a pad name or vN(x,y) marks a point on that pad's centre or on a via; arc(x,y) is an arc through that point)
+3.3V: length 979.3
  Top Layer w0.254: 14,156 18,152 18,142.85 R9.1 ; 14,156 4.99,146.99 R8.1 5.5,141.62 5.5,138.3 U16.3 U13.3 ; 14,156 16,156 ; U51.24 87.5,165.26 87.5,166.5 86.58,167.42 ; 62.91,165.92 C2.2 C1.2 73.53,165.92 ; 62.91,165.92 58.61,165.92 ESP1.VDD_2 ; 62.91,165.92 60.38,163.39 ESP1.VDD_1 ; 62.91,165.92 62.91,152.41 58,147.5 58,135 ; 87,107 87,100.47 U1.3 ; 87,107 R58.1 ; 87,107 87,145 75,157 75,166.5 ; 109.61,167.42 112.4,167.42 113.5,168.52 C8.2 114.86,168.5 119,168.5 ; 109.61,167.42 107.56,167.42 ; 109.61,167.42 109.61,154.89 118.5,146 118.5,134.45 ; U118.24 120.7,166.8 119,168.5 ; R47.1 132,137 ; 132,137 132,147 141.51,156.51 141.51,168.5 ; 132,137 132,122.5 ; 118.5,134.45 118.5,121 ; 118.5,134.45 121.94,131 R46.1 ; 73.53,165.92 74.42,165.92 75,166.5 ; 73.53,165.92 73.5,165.9 73.5,135.5 ; 75,166.5 75.92,167.42 C6.2 C3.2 86.58,167.42 ; 73.5,135.5 73.5,121 ; 73.5,135.5 R60.1 ; R66.1 163.5,136 ; 163.5,136 163.5,142.5 157.5,148.5 149,148.5 143.81,153.69 143.81,168.5 ; 163.5,136 163.5,121.5 ; R49.1 62,131 58,135 ; 142.68,168.5 142.68,152.9 149,146.58 149,135.5 ; 142.68,168.5 143.81,168.5 ; 142.68,168.5 141.51,168.5 ; 73.5,121 R65.1 ; 73.5,121 73.5,105.5 ; 118.5,121 R51.1 ; 118.5,121 118.5,105.5 ; 143.81,168.5 145.42,168.5 C10.2 C9.2 151.56,167.42 U119.24 ; 103,106 103,121.5 ; 103,106 103,100.47 U2.3 ; 103,106 R55.1 ; 103,121.5 R50.1 ; 103,121.5 103,136 ; 149,121 149,135.5 ; 149,121 R62.1 ; 149,121 149,105.5 ; 149,135.5 R64.1 ; 141.51,168.5 119,168.5 ; R56.1 118.5,105.5 ; 118.5,105.5 118.5,98.97 U3.3 ; U4.3 58,99.47 58,106.21 ; R54.1 58,121.5 ; 58,121.5 58,106.21 ; 58,121.5 58,135 ; 2.5,181.42 2.5,180.5 5,178 5.92,178 C12.2 C11.2 8.97,177.92 U50.20 ; 2.5,181.42 2.5,183 ; 2.5,181.42 2.89,181.03 U50.17 ; U8.3 163.5,98.97 163.5,106 ; R45.1 103,136 ; 103,136 103,145 107.56,149.56 107.56,167.42 ; 149,105.5 149,98.47 U5.3 ; 149,105.5 R61.1 ; U21.3 73.5,98.97 73.5,105.5 ; R59.1 58,106.21 ; C5.2 C4.2 19.7,183.62 U50.8 ; R69.1 163.5,106 ; 163.5,106 163.5,121.5 ; 86.58,167.42 107.56,167.42 ; 132,107 132,122.5 ; 132,107 132,100.47 U9.3 ; 132,107 R57.1 ; 132,122.5 R52.1 ; R63.1 73.5,105.5 ; 163.5,121.5 R67.1 ; 15.87,179.07 18.02,179.07 C13.1
AGND: length 23.8
  Top Layer w0.254: U50.9 18.27,184.28 20.5,186.5 20.5,202.95 CN1.K
GND: length 14.8
  Top Layer w0.254: 24,187 22.92,187 C5.1 C4.1 ; 12.5,179.72 13.22,179.72 13.88,180.38 U50.3 ; 12.5,179.72 13,179.22 v1(13,178) ; 12.5,179.72 U50.19 ; 5.51,177.09 5.5,177.08 ; v1(12.5,181) 11.82,181.68 U50.16
1S0: length 167.6
  Top Layer w0.254: U51.10 98.94,155.08 99.87,154.16 103.68,154.16 v1(105.2,155.68) ; v1(162.86,157.72) 164.13,157.72 164.64,157.21 164.64,156.29 U119.10 ; v1(65.33,174.48) 65.33,176 58.72,182.61 44.46,182.61 ESP1.35 ; U118.10 132.13,155.68 133.65,154.16 136.95,154.16 138.22,155.43 v1(139.49,155.43)
  Inner1 w0.254: v1(65.33,174.48) 86.41,174.48 v1(105.2,155.68)
  Inner2 w0.254: v1(139.49,155.43) 160.58,155.43 v1(162.86,157.72)
  Bottom Layer w0.254: v1(105.2,155.68) 107.74,155.68 108.25,155.18 139.24,155.18 v1(139.49,155.43)
1S1: length 166.6
  Top Layer w0.254: U119.11 165.96,155.52 164.65,154.2 162.87,154.2 v1(162.62,154.46) ; v1(139.25,156.23) 139.24,156.24 137.46,156.24 135.94,154.72 134.41,154.72 133.4,155.73 U118.11 ; U51.11 100.22,156.32 101.18,157.28 101.94,157.28 v1(102.96,156.26)
  Inner1 w0.254: v1(59.78,174.04) 60.03,173.79 73.94,173.79 91.46,156.26 v1(102.96,156.26)
  Inner2 w0.254: v1(59.78,174.04) 59.01,174.81 58.25,174.81 48.09,184.97 32.85,184.97 32.09,185.73 32.09,190.22 ESP1.36
  Bottom Layer w0.254: v1(102.96,156.26) 103.21,156.01 104.48,156.01 104.99,156.52 107.53,156.52 108.29,155.76 138.77,155.76 v1(139.25,156.23) 160.84,156.23 v1(162.62,154.46)
1S2: length 160
  Top Layer w0.254: v1(140.76,164.92) 140.51,165.17 139.94,165.17 138.92,164.16 134.41,164.16 133.4,165.17 U118.14 ; U51.14 100.38,165.08 100.38,164.41 101.14,163.65 101.65,163.65 102.41,164.41 v1(102.41,164.66) ; U119.14 165.91,165.67 165.91,165.17 164.89,164.16 v1(164.13,164.16)
  Inner1 w0.254: v1(164.13,164.16) 163.37,164.92 v1(140.76,164.92) ; v1(93.27,172.79) 75.99,190.06 57.2,190.06 55.93,191.33 35.74,191.33 ESP1.37
  Bottom Layer w0.254: v1(93.27,172.79) 96.06,172.79 103.17,165.68 103.17,165.17 ; 103.17,165.17 104.51,165.17 104.76,164.92 v1(140.76,164.92) ; 103.17,165.17 102.66,164.66 v1(102.41,164.66)
1S3: length 155.5
  Top Layer w0.254: U118.13 v1(140.76,165.73) ; v1(102.43,165.5) 101.74,165.5 U51.13 ; U119.13 167.24,165.73 v1(167.94,165.73)
  Inner1 w0.254: v1(167.94,165.73) v1(140.76,165.73) 138.46,168.04 124.78,168.04 121.99,165.24 102.69,165.24 v1(102.43,165.5)
  Inner2 w0.254: v1(85.16,164.74) 83.38,162.96 75.25,162.96 60.78,177.44 58.24,177.44 49.42,186.25 ESP1.38
  Bottom Layer w0.254: v1(85.16,164.74) 85.92,165.5 v1(102.43,165.5)
A0: length 52.1
  Top Layer w0.254: R49.2 65.5,144.5 v1(71.5,150.5) ; v1(97.5,152.5) 97.67,152.68 U51.9
  Inner2 w0.254: v1(97.5,152.5) 95.5,150.5 v1(71.5,150.5)
A1: length 61.5
  Top Layer w0.254: v1(103.52,146.56) 102.5,146.56 96.41,152.66 U51.8 96.41,152.41 95,151
  Inner2 w0.254: R47.2 140.43,131.07 139.58,131.07 124.09,146.56 v1(103.52,146.56)
A2: length 41.8
  Top Layer w0.254: v1(95.64,154.18) 95.14,154.69 U51.7
  Bottom Layer w0.254: v1(95.64,154.18) 96.91,154.18 112.92,138.18 112.92,137.16 118,132.08 123.58,132.08 124.6,131.07 125.43,131.07 R46.2
A3: length 32.1
  Top Layer w0.254: U51.6 93.86,152.4 v1(94.63,151.64)
  Bottom Layer w0.254: v1(94.63,151.64) 95.39,151.64 110.38,136.66 110.38,131.12 R45.2
A4: length 26.3
  Top Layer w0.254: R48.2 95.9,131.4 95.9,149.36 92.59,152.66 U51.5
A5: length 51.4
  Top Layer w0.254: v1(93.1,149.86) 91.33,151.64 U51.4
  Inner2 w0.254: v1(93.1,149.86) 65.5,122.26 R54.2
A6: length 67.5
  Top Layer w0.254: U51.3 90.06,154.44 v1(90.56,153.93)
  Bottom Layer w0.254: v1(90.56,153.93) 93.61,153.93 129.93,117.61 138.57,117.61 139.58,116.59 140.41,116.59 R52.2
A7: length 55.7
  Top Layer w0.254: v1(94.88,147.07) 88.78,153.17 U51.2
  Bottom Layer w0.254: R51.2 125.41,116.59 124.6,116.59 115.71,125.48 114.44,125.48 109.36,130.56 109.36,131.83 94.88,146.31 v1(94.88,147.07)
A8: length 60.6
  Top Layer w0.254: U51.23 88.78,159.86 86.25,157.32 86.25,154.27 93.86,146.65 93.86,133.95 v1(93.61,133.7)
  Bottom Layer w0.254: v1(93.61,133.7) 94.37,133.7 96.91,131.16 96.91,129.89 109.94,116.86 110.14,116.86 R50.2
A9: length 53.7
  Top Layer w0.254: U51.22 90.06,160.62 86.75,157.32 86.75,154.27 94.37,146.65 94.37,117.63 R53.2
A10: length 74.8
  Top Layer w0.254: U51.21 91.33,160.37 v1(88.53,157.57)
  Bottom Layer w0.254: R59.2 65.67,101.22 65.67,107.16 88.53,130.01 v1(88.53,157.57)
A11: length 88.4
  Top Layer w0.254: U51.20 92.59,161.38 v1(96.41,157.57)
  Bottom Layer w0.254: R57.2 140.5,114.8 141.62,115.92 141.62,116.93 140.85,117.69 139.08,117.69 126.89,129.89 126.89,131.16 125.87,132.17 124.09,132.17 116.22,140.05 113.93,140.05 v1(96.41,157.57)
A12: length 77.3
  Top Layer w0.254: U51.19 93.86,163.92 v1(95.39,162.4)
  Inner2 w0.254: R56.2 124.34,102.16 124.34,124.81 102.75,146.4 102.75,155.03 v1(95.39,162.4)
A13: length 71
  Top Layer w0.254: U51.18 v1(95.14,163.67)
  Inner2 w0.254: v1(95.14,163.67) 94.63,163.16 94.63,162.15 102.25,154.53 102.25,115.03 110.5,106.78 R55.2
A14: length 66.1
  Top Layer w0.254: v1(97.17,157.83) 96.41,158.59 U51.17
  Inner2 w0.254: v1(97.17,157.83) 98.18,156.81 98.18,152.24 96.66,150.72 96.66,102.16 R58.2
A15: length 73.1
  Top Layer w0.254: v1(106.82,155.03) 97.67,164.18 U51.16
  Bottom Layer w0.254: R64.2 154.83,132.17 129.68,132.17 v1(106.82,155.03)
B0: length 50.2
  Top Layer w0.254: v1(156,123.68) 156,116.5 ; U118.9 130.86,153.91 v1(134.41,150.35)
  Inner2 w0.254: v1(134.41,150.35) 134.41,145.27 v1(156,123.68)
B1: length 66.8
  Top Layer w0.254: v1(131.37,151.87) 129.59,153.65 U118.8
  Inner2 w0.254: v1(131.37,151.87) 130.6,151.11 130.6,147.23 154.73,123.1 154.73,102.27 R61.2
B2: length 58.9
  Top Layer w0.254: U118.7 128.32,155.18 v1(127.56,154.41)
  Inner1 w0.254: v1(127.56,154.41) 119.17,154.41 96.82,132.06 81.56,132.06 R60.2
B3: length 74.5
  Top Layer w0.254: v1(126.79,153.65) 126.79,155.99 U118.6
  Inner1 w0.254: R63.2 80.5,107.36 v1(126.79,153.65)
B4: length 74
  Top Layer w0.254: v1(131.37,147.3) 125.78,152.89 U118.5
  Inner2 w0.254: v1(131.37,147.3) 171,107.67 R69.2
B5: length 67.8
  Top Layer w0.254: v1(132.89,157.91) 125.62,157.91 124.51,156.8 U118.4
  Inner2 w0.254: v1(132.89,157.91) 134.92,157.91 170.99,121.84 170.99,116.51 R67.2
B6: length 60.5
  Top Layer w0.254: v1(137.21,156.8) 135.43,158.58 125.02,158.58 123.24,156.8 U118.3
  Inner2 w0.254: R66.2 169.84,132.16 161.85,132.16 v1(137.21,156.8)
B7: length 59.1
  Top Layer w0.254: v1(115.62,149.84) 116.89,149.84 121.97,154.92 U118.2
  Inner1 w0.254: v1(115.62,149.84) 115.11,149.84 96.57,131.3 96.57,130.54 91.49,125.46 90.22,125.46 81.33,116.57 80.57,116.57 R65.2
B8: length 189.6
  Top Layer w0.254: v1(140.73,159.87) 126.51,159.87 121.97,164.41 U118.23
  Inner2 w0.254: R68.2 147.84,159.87 146.32,158.35 142.25,158.35 v1(140.73,159.87)
B9: length 187.4
  Top Layer w0.254: U118.22 123.24,166.8 124.51,168.07 140.51,168.07 v1(140.76,167.81)
  Inner1 w0.254: R5.2 249.61,172.97 244.46,167.81 v1(140.76,167.81)
B10: length 196.1
  Top Layer w0.254: v1(128.06,160.6) 124.51,164.16 U118.21
  Inner2 w0.254: v1(128.06,160.6) 149.15,139.52 149.15,131.39 208.33,72.21 208.33,18.36 208.84,17.85 220.53,17.85 R6.2
B11: length 182.9
  Top Layer w0.254: v1(129.33,160.6) 125.78,164.16 U118.20
  Inner2 w0.254: R7.2 209.39,71.91 193.85,87.45 193.85,89.48 194.61,90.24 194.61,91.51 176.07,110.05 175.82,110.05 169.72,116.15 169.72,116.91 161.08,125.55 159.81,125.55 154.73,130.63 154.73,132.15 149.65,137.23 149.65,140.28 v1(129.33,160.6)
B12: length 132
  Top Layer w0.254: U118.19 127.05,166.29 126.03,167.31 v1(125.02,167.31)
  Inner1 w0.254: v1(54.66,142.92) 54.91,142.67 100.63,142.67 125.02,167.05 v1(125.02,167.31)
  Inner2 w0.254: v1(54.66,142.92) 43.74,142.92 42.97,143.68 9.04,143.68 R8.2
B13: length 119.7
  Top Layer w0.254: U118.18 128.32,165.17 v1(127.05,163.9)
  Inner1 w0.254: v1(127.05,163.9) 105.2,142.06 v1(54.66,142.06)
  Inner2 w0.254: R9.2 20.98,143.33 42.72,143.33 43.99,142.06 v1(54.66,142.06)
BCK: length 34.5
  Top Layer w0.254: v1(5.5,184.5) 6.38,183.62 U50.13
  Inner1 w0.254: v1(5.5,184.5) 6,185 11,185 12.5,183.5 13.5,183.5 15.83,181.17 ESP1.40
C0: length 140.3
  Top Layer w0.254: v1(163.93,154.91) 163.42,155.42 163.42,156.23
  Inner1 w0.254: v1(163.93,154.91) 147.42,138.4 147.42,130.78 113.38,96.75 113.38,81.51 82.63,50.75 U21.2
C1: length 132.6
  Top Layer w0.254: v1(158.85,148.06) 158.85,151.61 162.15,154.91 U119.8
  Inner1 w0.254: U1.2 96.87,50.9 96.87,55.76 116.94,75.82 116.94,99.54 158.85,141.45 v1(158.85,148.06)
C2: length 125.5
  Top Layer w0.254: v1(157.83,150.59) 157.83,151.87 160.88,154.91 U119.7
  Inner1 w0.254: v1(112.62,85.06) 112.88,85.32 112.88,97 146.91,131.04 146.91,138.91 157.83,149.83 v1(157.83,150.59)
  Bottom Layer w0.254: U2.2 112.62,50.85 v1(112.62,85.06)
C3: length 144.7
  Top Layer w0.254: v1(157.32,152.37) 159.61,154.66 U119.6
  Inner1 w0.254: v1(157.32,152.37) 145.13,140.18 143.86,140.18 92.9,89.22 92.9,82.46 66.72,56.28 U4.2
C4: length 123.3
  Top Layer w0.254: v1(156.56,152.88) 158.34,154.66 U119.5
  Inner1 w0.254: v1(142.59,66.78) 142.59,65.76 127.61,50.77 126.75,50.77 U3.2
  Bottom Layer w0.254: v1(142.59,66.78) 142.59,99.03 144.12,100.56 144.12,101.57 142.34,103.35 142.34,110.97 159.61,128.24 159.61,131.55 156.31,134.85 156.31,152.63 v1(156.56,152.88)
C5: length 112.9
  Top Layer w0.254: U119.4 157.07,154.66 v1(156.56,154.15)
  Bottom Layer w0.254: v1(156.56,154.15) 155.8,153.39 155.8,133.83 157.07,132.56 157.07,126.21 141.72,110.86 U9.2
C6: length 109
  Top Layer w0.254: v1(157.07,150.14) 155.8,151.41 155.8,156.23
  Inner2 w0.254: U5.2 157.32,50.35 v1(157.32,58.19)
  Bottom Layer w0.254: v1(157.07,150.14) 157.07,134.64 160.12,131.6 160.12,126.04 157.32,123.25 v1(157.32,58.19)
C7: length 136.6
  Top Layer w0.254: v1(165.45,159.08) 165.2,159.33 156.31,159.33 154.53,157.56 U119.2 ; U6.2 283.11,159.08 v1(283.06,159.08)
  Inner2 w0.254: v1(165.45,159.08) 239.37,159.08 241.65,156.79 244.92,156.79 247.46,159.33 282.8,159.33 v1(283.06,159.08)
C8: length 126.8
  Top Layer w0.254: U8.2 172.06,50.41 172.06,153.48 165.45,160.08 158.59,160.08 154.53,164.15 U119.23
C9: length 135.9
  Top Layer w0.254: 155.8,165.72 155.8,166.79 160.37,171.36 v1(165.96,171.36)
  Inner2 w0.254: 286.51,174.52 286.37,174.66 221.52,174.66 220.51,175.68 215.24,175.68 214.22,174.66 194.38,174.66 191.07,171.36 v1(165.96,171.36)
C10: length 179.3
  Top Layer w0.254: v1(155.8,163.94) 157.07,165.21 U119.21
  Inner1 w0.254: U16.2 10.6,96.13 22.71,96.13 24.74,94.09 41.75,94.09 44.55,96.89 84.43,96.89 128.12,140.58 132.43,140.58 v1(155.8,163.94)
C11: length 197.3
  Top Layer w0.254: v1(156.56,163.44) 158.34,165.21 U119.20
  Inner1 w0.254: v1(156.56,163.44) 133.19,140.07 128.12,140.07 84.43,96.38 49.12,96.38 8.28,55.54 U12.2
C12: length 167.8
  Top Layer w0.254: v1(157.07,162.67) 159.61,165.21 U119.19
  Inner1 w0.254: v1(157.07,162.67) 157.07,162.42 126.84,132.19 120.75,132.19 84.43,95.87 50.14,95.87 v1(48.87,94.6)
  Bottom Layer w0.254: v1(48.87,94.6) 48.36,94.09 22.7,94.09 U13.2
C13: length 174.5
  Top Layer w0.254: U119.18 160.88,165.16 197.2,128.84 197.2,127.57 v1(207.62,117.16)
  Inner2 w0.254: U15.2 305.29,103.19 302.61,103.19 301.34,101.92 280.96,101.92 279.94,102.93 262.54,102.93 248.32,117.16 v1(207.62,117.16)
C14: length 191.8
  Top Layer w0.254: U119.17 162.15,164.91 197.71,129.35 197.71,128.08 208.38,117.41 208.38,110.3 237.84,80.84 237.84,50.86 v1(238.1,50.61)
  Inner2 w0.254: v1(238.1,50.61) 238.1,16.93 U14.2
COL1: length 651.4
  Top Layer w0.254: U55.1 38.19,25.6 D9.1 40.95,12.75 U63.1 ; U55.1 43.33,48.18 36.83,54.68 U79.1 ; U55.1 50,37.41 v1(50,37.5) ; D41.1 177.75,194.75 182.31,190.19 171.77,190.19 ; v1(133.28,191.33) 135.68,191.33 U111.1 136.71,192.47 D57.1 D49.1 156.99,193.99 154.22,191.22 U103.1 ; D1.1 D33.1 52.69,100.19 40.86,88.35 D17.1 25.73,69.04 ; 25.73,69.04 36.83,80.13 U71.1 ; 25.73,69.04 D25.1 ; v1(58.5,151.5) 50.09,151.5 U87.1 ; 147.5,157.5 v1(146,159)
  Inner2 w0.254: 133.31,191.31 133.33,191.33 ; 133.31,191.31 130.5,188.5 130.5,186 126,181.5 ; 133.31,191.31 v1(133.28,191.33) ; 126,181.5 115.5,171 93,171 73.08,151.08 71.26,151.08 55,134.83 55,102.5 v1(52.5,100) ; 126,181.5 142,165.5 142,163 v1(146,159) ; 126,181.5 116.17,191.33 v1(102.5,191.33)
  Bottom Layer w0.254: v1(50,37.5) 57.5,45 57.5,95 v1(52.5,100) ; U111.1 136.89,190.12 U103.1 154.29,190.19 171.77,190.19 ; v1(58.5,151.5) 71,151.5 102.5,183 v1(102.5,191.33) ESP1.8
COL2: length 550.3
  Top Layer w0.254: D34.1 v1(53.19,143.54) ; ESP1.9 70.05,198.95 94.75,174.25 D58.1 ; D18.1 D26.1 53.19,39 D2.1 61.56,30.64 U56.1 63.83,30.45 U64.1 62.96,12.73 D10.1 ; D58.1 143.62,174.25 ; D58.1 D50.1 D42.1 193.8,154.95 198.37,154.95 v1(238.5,114.82)
  Inner1 w0.254: v1(53.19,143.54) 53.19,188.33 v1(55.59,190.73)
  Inner2 w0.254: U56.1 63.32,31.33 45.03,31.33 44.01,32.35 23.9,32.35 U72.1
  Bottom Layer w0.254: ESP1.9 55.59,195.95 v1(55.59,190.73) ; U112.1 301.52,18.45 U104.1 301.32,36.17 U96.1 301.14,53.77 U88.1 301.01,71.28 301.01,88.81 300.91,88.91 275.46,88.91 249.55,114.82 v1(238.5,114.82)
COL3: length 660.9
  Top Layer w0.254: U73.1 255.1,144.15 276.95,122.31 291.68,122.31 307.43,106.56 307.43,103.29 317.59,93.13 317.59,91.6 D27.1 D35.1 D43.1 317.69,39 D51.1 D59.1 ; D3.1 82.46,30.73 U57.1 U65.1 82.96,12.73 D11.1 ; v1(42.44,34) D19.1
  Inner2 w0.254: U57.1 80.54,35.02 43.45,35.02 v1(42.44,34)
  Bottom Layer w0.254: ESP1.10 58.76,201.32 93.62,201.32 111.15,183.8 134.16,183.8 192.33,125.63 192.84,125.63 ; U73.1 211.17,144.15 U81.1 192.84,125.63 ; U57.1 103.37,49.27 142.48,49.27 150.61,57.4 192.17,57.4 U113.1 U105.1 192.78,90.86 U97.1 192.91,108.55 U89.1 192.84,125.63
COL4: length 548.8
  Top Layer w0.254: U114.1 211.64,56.55 D60.1 ; D4.1 102.89,30.81 U58.1 U66.1 105.03,12.66 D12.1 ; U74.1 273.06,146.5 D20.1 264.22,145.03 255.69,145.03 254.42,146.3 v1(243.75,146.3) ; D44.1 211.72,91.47 U98.1 ; D36.1 211.48,108.72 U90.1 ; U82.1 211.7,126.49 D28.1 164.73,173.46 94.88,173.46 70.5,197.84 58.05,197.84 57.29,198.6 57.29,202.73 ESP1.11 ; U106.1 210.99,74.2 D52.1
  Inner1 w0.254: v1(243.75,146.3) 241.72,146.3 U82.1
  Bottom Layer w0.254: U82.1 222.1,126.3 U90.1 222.27,108.55 U98.1 U106.1 222.27,56.68 ; 222.27,56.68 U114.1 ; 222.27,56.68 U114.1 ; U114.1 200.94,35.35 199.57,35.35 arc(199.18,35.29) 198.78,35.35 194.65,35.35 193.5,36.5 110,36.5 105.84,32.34 U58.1
COL5: length 518.7
  Top Layer w0.254: D21.1 289.95,145.26 278.56,145.26 276.02,142.72 257.48,142.72 254.43,145.76 249.35,145.76 243.76,140.18 v1(243.76,133.57) ; U75.1 192.83,34.23 U83.1 222.55,34.23 238.69,50.37 D61.1 D53.1 D45.1 D37.1 239.19,112 D29.1 v1(242.24,132.05) ; U59.1 126.85,12.76 U67.1 ; U59.1 122.19,26.38 D13.1 ; U59.1 124.89,33 D5.1 ; U91.1 215.59,173.83 U107.1
  Inner1 w0.254: v1(242.24,132.05) v1(243.76,133.57)
  Inner2 w0.254: U59.1 130.97,35.16 191.9,35.16 U75.1
  Bottom Layer w0.254: U115.1 215.8,154.75 U107.1 ; ESP1.12 58.85,206.82 118.49,206.82 120.78,204.54 135,204.54 137.04,206.57 148.47,206.57 150.47,204.56 152.76,204.56 154.54,206.34 158.35,206.34 U91.1 190.82,173.79 U99.1
COL6: length 506.8
  Top Layer w0.254: D6.1 D14.1 143.56,16.5 U68.1 147.82,30.65 U60.1 ; D22.1 208.43,36.5 v1(207.61,35.69) ; ESP1.13 62.31,212.82 167.56,212.82 170.86,209.52 174.67,209.52 D38.1 217.74,176.5 219.52,178.28 230.91,178.28 D54.1 233,176.19 233,157.81 D62.1 243,146.19 243,129.5 249.81,122.69 U76.1 U84.1 250.13,101.18 U92.1 U100.1 ; 216.94,176.5 217.45,175.99 217.45,173.45 207.19,163.19 D46.1 ; 250.07,67.46 250.07,49.94 250.33,49.68 U116.1 242.62,32.57 D30.1
  Inner1 w0.254: 250.07,49.94 250.07,67.4 U100.1
  Inner2 w0.254: U60.1 166.47,30.93 168.03,32.49 172,32.49 172.45,32.04 185.19,32.04 188.13,29.11 201.03,29.11 v1(207.61,35.69)
COL7: length 502.1
  Top Layer w0.254: 275.47,83.22 U93.1 ; 275.47,83.22 275.47,81.56 271.91,78.01 271.91,70.01 ; 275.47,83.22 272.18,86.5 ; U69.1 168.45,12.23 D15.1 ; U69.1 168.82,30.9 U61.1 166.72,33 D7.1 163.68,33 108.57,88.12 108.57,92.18 93.07,107.68 93.07,112.95 87.48,118.53 87.48,151.27 75.55,163.21 75.55,166.1 v1(75.8,166.35) ; U69.1 198.54,12.23 213.78,27.47 259.16,27.47 D63.1 273.26,35 U117.1 ; U109.1 272.42,52.48 ; 272.42,52.48 272.42,62.48 275.47,65.53 275.47,66.45 ; 272.42,52.48 266.71,52.48 D55.1 ; 271.91,70.01 275.47,66.45 ; 271.91,70.01 266.7,70.01 D47.1 ; 272.66,103.91 272.66,115.6 U77.1 268.52,118.17 D23.1 ; 272.66,103.91 U85.1 272.18,98.35 272.18,86.5 ; 272.66,103.91 266.28,103.91 D31.1 ; 275.47,66.45 U101.1 ; 272.18,86.5 D39.1
  Inner2 w0.254: U117.1 U109.1 ; v1(75.8,166.35) 59.54,182.61 58.02,182.61 57.51,183.11 57.51,210.57 ESP1.14
COL8: length 463.3
  Top Layer w0.254: D16.1 185.19,32.5 D8.1 ; D24.1 291.69,120.77 D32.1 292.19,103.5 D40.1 D48.1 D56.1 D64.1 290.67,33.48 281.43,33.48 278.89,36.02 266.19,36.02 263.65,33.48 253.49,33.48 248.95,28.94 188.76,28.94 D8.1 ; D8.1 183.68,33 123.99,92.69 108.75,92.69 93.51,107.93 93.51,113.2 87.92,118.79 87.92,151.87 v1(76.23,163.56)
  Inner2 w0.254: ESP1.21 34.32,205.44 34.32,203.94 58.2,180.07 58.71,180.07 75.22,163.56 v1(76.23,163.56)
DIN: length 30.3
  Top Layer w0.254: U50.14 8.03,182.97 v1(8,183)
  Inner1 w0.254: ESP1.42 33.02,175.92 25.08,175.92 22,179 12,179 v1(8,183)
DIN_IN: length 85.6
  Top Layer w0.254: v1(89.84,180.15) 109.16,180.15 R4.2 109.16,184.52 U11.5
  Bottom Layer w0.254: v1(89.84,180.15) 89.58,179.9 44.63,179.9 ESP1.RX
LRCK: length 25.7
  Top Layer w0.254: U50.15 11.32,182.32 v1(11.5,182.5) ; ESP1.41 32.07,177.5 v1(26.5,177.5)
  Bottom Layer w0.254: v1(26.5,177.5) 17.5,177.5 13.5,181.5 13,181.5 12,182.5 v1(11.5,182.5)
MUXA_OUT: length 61.9
  Top Layer w0.254: U51.1 87.52,157.08 v1(87.77,157.33)
  Inner1 w0.254: v1(87.77,157.33) 75.36,169.74 56.06,169.74 v1(54.79,171.01)
  Inner2 w0.254: v1(54.79,171.01) ESP1.1
MUXB_OUT: length 96
  Top Layer w0.254: U118.1 120.7,156.29 v1(110.28,166.71)
  Inner1 w0.254: v1(110.28,166.71) 94.79,166.71 86.41,175.09 59.07,175.09 58.82,174.84 55.93,174.84 v1(54.66,173.56)
  Inner2 w0.254: v1(54.66,173.56) 33.21,173.56 ESP1.2
OUTL: length 27.7
  Top Layer w0.254: U50.6 v1(13,182.32)
  Bottom Layer w0.254: 14.5,198 12.6,199.9 CN1.J ; 14.5,198 11.5,195 11.5,183.82 v1(13,182.32) ; 14.5,198 17.05,200.55 CN1.I
OUTR: length 41.1
  Top Layer w0.254: U50.7 14.03,182.97 12,185 12,197.5 7.5,202 7.5,206.95 CN1.G CN1.C
ROW1: length 69
  Top Layer w0.254: ESP1.4 57.44,169.85 57.44,162.91 59.21,161.13 59.21,151.23 57.44,149.45 57.44,129.13 D1.2 43.45,121 U54.2
  Bottom Layer w0.254: U54.2 39.36,121.27 U54.1
ROW2: length 182.3
  Top Layer w0.254: v1(57.41,128.28) 57.41,90.18 35.06,67.82 35.06,64.27 36.33,63 36.33,17.02 D9.2 29.38,15.5 U62.2 25.2,15.87 U62.1
  Bottom Layer w0.254: v1(57.41,128.28) 57.41,172.37 ESP1.5
ROW3: length 111.7
  Bottom Layer w0.254: U70.1 10.59,87.19 10.59,95.32 9.32,96.59 9.32,123 24.05,137.74 24.05,141.55 ESP1.6
ROW4: length 132.5
  Bottom Layer w0.254: ESP1.7 23.54,143.58 23.54,137.74 7.54,121.73 7.54,70.02 9.49,68.07
ROW5: length 92.3
  Top Layer w0.254: ESP1.15 35.23,157.8 35.23,100.83 U86.1
ROW6: length 127
  Inner2 w0.254: ESP1.16 93.49,183.71 120.41,210.63 134.8,210.63 136.07,209.36 149.08,209.36 152.38,212.67 170.53,212.67 U94.1
ROW7: length 139
  Top Layer w0.254: v1(127.75,195.75) 143.12,211.12 U102.1 143.18,211.12 118.31,186.25 83.63,186.25 v1(83.38,186.5)
  Inner2 w0.254: ESP1.17 58.85,186.5 v1(83.38,186.5)
ROW8: length 169.6
  Inner1 w0.254: ESP1.18 54,184.19 54,108.29
  Inner2 w0.254: ESP1.18 80.89,211.08 U110.1
  vias: v1(54,108.29)
TX: length 71.4
  Top Layer w0.254: 89.11,194.96 87.51,193.36 v1(87.3,193.36)
  Bottom Layer w0.254: ESP1.TX 31.93,167.2 31.93,168.72 32.94,169.74 33.45,169.74 53.77,190.06 55.8,190.06 58.34,192.6 86.54,192.6 v1(87.3,193.36)
$1N26761: length 6.2
  Top Layer w0.254: D2.2 55.54,33.27 U55.2
$1N26911: length 6.2
  Top Layer w0.254: D4.2 91.44,33 U57.2
$1N26913: length 6.5
  Top Layer w0.254: 70.36,33.18 76.63,33.18 D3.2
$1N27211: length 6.8
  Top Layer w0.254: D6.2 133.78,33 U59.2
$1N27213: length 6.8
  Top Layer w0.254: D5.2 112.53,33 U58.2
$1N27215: length 6.4
  Top Layer w0.254: U61.2 180.78,33.53 D8.2
$1N27217: length 6.5
  Top Layer w0.254: U60.2 160.34,33.47 D7.2
$1N32107: length 7.1
  Top Layer w0.254: U65.2 96.58,15.27 D12.2
$1N32109: length 6.1
  Top Layer w0.254: D11.2 74.58,15.27 U64.2
$1N32111: length 7.2
  Top Layer w0.254: 112.19,15.2 117.51,15.2 D13.2
$1N32113: length 7.3
  Top Layer w0.254: D16.2 180.08,14.77 U69.2
$1N32117: length 7.1
  Top Layer w0.254: U67.2 138.58,15.27 D14.2
$1N32119: length 7.3
  Top Layer w0.254: D15.2 160.55,16.55 158.77,14.77 U68.2
$1N32129: length 6.6
  Top Layer w0.254: D10.2 54.59,15.29 U63.2
$1N33315: length 6.8
  Top Layer w0.254: 15.59,88.38 22.32,88.38 D17.2
$1N33317: length 6.7
  Top Layer w0.254: U71.2 49.58,84.27 D18.2
$1N33319: length 6.1
  Top Layer w0.254: D19.2 35.18,33.87 U72.2
$1N33321: length 6
  Top Layer w0.254: D20.2 262.12,146.69 U73.2
$1N33323: length 6.7
  Top Layer w0.254: D21.2 281.9,147 U74.2
$1N33325: length 6.7
  Top Layer w0.254: U75.2 205.54,36.77 D22.2
$1N33327: length 6.7
  Top Layer w0.254: D23.2 262.63,120.68 U76.2
$1N33329: length 6.7
  Top Layer w0.254: U77.2 281.7,120.83 D24.2
$1N33345: length 7.1
  Top Layer w0.254: D25.2 17.45,69 U78.2
$1N33347: length 6.7
  Top Layer w0.254: D26.2 49.58,67.27 U79.2
$1N33349: length 7
  Top Layer w0.254: D27.2 314.15,91.34 U80.2
$1N33351: length 7
  Top Layer w0.254: U81.2 206.26,128.55 D28.2
$1N33353: length 7.6
  Top Layer w0.254: U82.2 235.78,129.03 D29.2
$1N33355: length 6.8
  Top Layer w0.254: D30.2 228.91,36.5 U83.2
$1N33357: length 6.7
  Top Layer w0.254: D31.2 262.77,104.04 U84.2
$1N33359: length 6.8
  Top Layer w0.254: D32.2 281.64,104 U85.2
$1N35743: length 6.6
  Top Layer w0.254: D33.2 49.4,101.6 ; U86.2 49.23,101.77 49.5,101.5
$1N35745: length 6.7
  Top Layer w0.254: D34.2 43.45,140.5 U87.2
$1N35747: length 6.9
  Top Layer w0.254: D35.2 314.12,73.69 U88.2
$1N35749: length 6.7
  Top Layer w0.254: U89.2 205.65,111.15 D36.2
$1N35751: length 7
  Top Layer w0.254: U90.2 235.06,111.26 D37.2
$1N35753: length 7.2
  Top Layer w0.254: D38.2 204.18,176.37 U91.2
$1N35755: length 6.9
  Top Layer w0.254: U92.2 263.16,86.65 D39.2
$1N35757: length 6.9
  Top Layer w0.254: D40.2 282.12,86 U93.2
$1N35773: length 6.7
  Top Layer w0.254: U94.2 174.49,204.82 D41.2
$1N35775: length 6.3
  Top Layer w0.254: U95.2 174.49,183.65 D42.2
$1N35777: length 6.7
  Top Layer w0.254: 307.67,56.13 307.8,56 D43.2
$1N35779: length 7.1
  Top Layer w0.254: 199.25,93.53 206.28,93.53 D44.2
$1N35781: length 7.1
  Top Layer w0.254: D45.2 234.32,94.02 228.62,94.02
$1N35783: length 6.7
  Top Layer w0.254: D46.2 197.44,157 U99.2
$1N35785: length 6.8
  Top Layer w0.254: U100.2 263.31,70 D47.2
$1N35787: length 7
  Top Layer w0.254: U101.2 288.63,69.24 288.81,69.06 288.81,68.99
$1N35803: length 6.7
  Top Layer w0.254: D49.2 156.99,204.54 U102.2
$1N35805: length 6.2
  Top Layer w0.254: U103.2 156.76,177.91 D50.2
$1N35807: length 6.9
  Top Layer w0.254: D51.2 307.88,38.5 U104.2
$1N35809: length 6.7
  Top Layer w0.254: 199.13,75.97 205.78,75.97 D52.2
$1N35811: length 6.8
  Top Layer w0.254: 228.62,76.74 235.05,76.74 D53.2
$1N35813: length 7.2
  Top Layer w0.254: U107.2 229.23,176.58 D54.2
$1N35815: length 6.9
  Top Layer w0.254: D55.2 256.44,52.5 U108.2
$1N35817: length 6.8
  Top Layer w0.254: D56.2 288.59,51.72 U109.2
$1N35833: length 6.6
  Top Layer w0.254: U110.2 139.08,198.23 D57.2
$1N35835: length 6.4
  Top Layer w0.254: 139.25,183.95 139.25,177.89 D58.2
$1N35837: length 6.9
  Top Layer w0.254: D59.2 314.67,20.86 U112.2
$1N35839: length 6.8
  Top Layer w0.254: D60.2 205.48,59.33 199.13,59.33
$1N35841: length 6.9
  Top Layer w0.254: D61.2 235.22,59.09 U114.2
$1N35843: length 6.7
  Top Layer w0.254: D62.2 228.54,157.27 U115.2
$1N35845: length 6.7
  Top Layer w0.254: D63.2 256.8,35 U116.2
$1N35847: length 6.8
  Top Layer w0.254: D64.2 282.15,35 U117.2
$1N41810: length 5.2
  Top Layer w0.254: C14.1 20.93,179.72 U50.2
$1N41812: length 7.8
  Top Layer w0.254: C15.1 22.2,182.5 20,182.5 19.18,181.68 U50.5
$1N41842: length 3
  Top Layer w0.254: C16.2 7.97,180.38 U50.18
$1N41846: length 7.9
  Top Layer w0.254: R1.2 89.11,199.16 U49.5
$1N41847: length 7
  Top Layer w0.254: R2.2 84.47,201.2 U49.4
$1N41854: length 8.6
  Top Layer w0.254: R3.2 109.78,198.49 U10.4
$1N41855: length 2.9
  Top Layer w0.254: R3.1 112.18,194.34 U11.1
$1N41856: length 11.9
  Top Layer w0.254: U10.5 115.41,200.32 112.87,197.78 111.6,197.78 109.57,195.75 109.57,194.28 U11.2
$1N41902: length 5.2
  Top Layer w0.254: U50.4 20.82,181.03 C14.2
